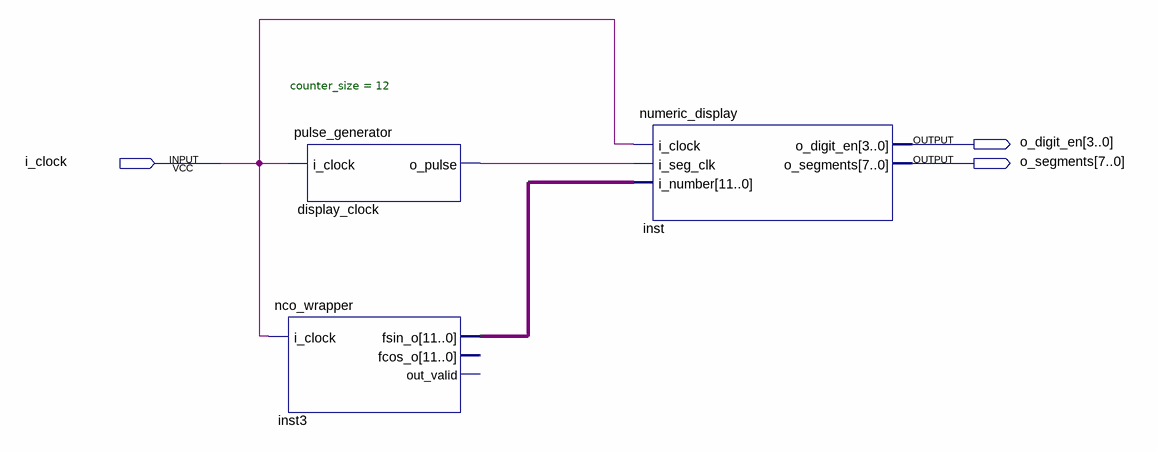
[diagram p0: schematic sheet]
// Quartus schematic experiments.bdf as structural Verilog: 3 symbols, 3 pins
module experiments (
  input  i_clock,
  output [3:0] o_digit_en,
  output [7:0] o_segments
);

  wire display_clock_o_pulse;
  wire [11:0] inst3_fsin_o;

  pulse_generator #(.counter_size(12)) display_clock (.i_clock(i_clock), .o_pulse(display_clock_o_pulse));
  nco_wrapper inst3 (.i_clock(i_clock), .fsin_o(inst3_fsin_o));  // open: fcos_o, out_valid
  numeric_display inst (
    .i_clock(i_clock), .i_seg_clk(display_clock_o_pulse), .i_number(inst3_fsin_o), .o_digit_en(o_digit_en),
    .o_segments(o_segments));
endmodule
